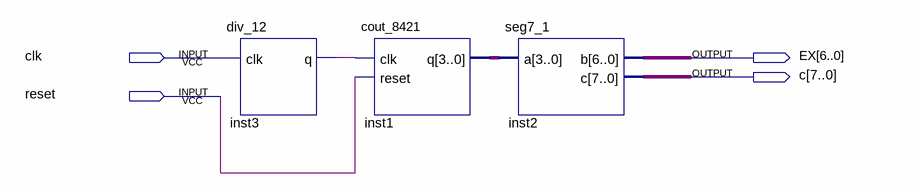
[diagram p0: schematic sheet]
// Quartus schematic EX3.bdf as structural Verilog: 3 symbols, 4 pins
module EX3 (
  input  clk,
  input  reset,
  output [6:0] EX,
  output [7:0] c
);

  wire inst3_q;
  wire [3:0] inst1_q;

  div_12 inst3 (.clk(clk), .q(inst3_q));
  cout_8421 inst1 (.clk(inst3_q), .reset(reset), .q(inst1_q));
  seg7_1 inst2 (.a(inst1_q), .b(EX), .c(c));
endmodule
